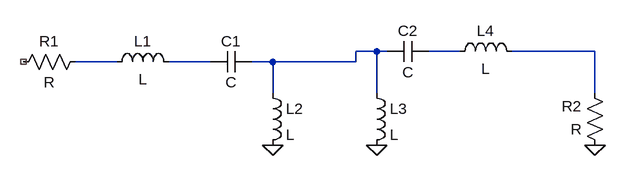
[diagram p0: schematic Draft7.asc]
Draft7.asc, the LTspice schematic file:
Version 4
SHEET 1 880 680
WIRE 368 112 336 112
WIRE 384 112 368 112
WIRE 496 112 448 112
WIRE 704 112 576 112
WIRE -32 128 -96 128
WIRE 112 128 48 128
WIRE 208 128 176 128
WIRE 336 128 336 112
WIRE 336 128 208 128
WIRE 208 176 208 128
WIRE 368 176 368 112
WIRE 704 176 704 112
FLAG 368 256 0
FLAG 704 256 0
FLAG 208 256 0
SYMBOL res -80 112 R90
WINDOW 0 0 56 VBottom 2
WINDOW 3 32 56 VTop 2
SYMATTR InstName R1
SYMBOL res 720 272 R180
WINDOW 0 36 76 Left 2
WINDOW 3 36 40 Left 2
SYMATTR InstName R2
SYMBOL ind -48 144 R270
WINDOW 0 32 56 VTop 2
WINDOW 3 5 56 VBottom 2
SYMATTR InstName L1
SYMBOL ind 192 160 R0
SYMATTR InstName L2
SYMBOL ind 352 160 R0
SYMATTR InstName L3
SYMBOL ind 480 128 R270
WINDOW 0 32 56 VTop 2
WINDOW 3 5 56 VBottom 2
SYMATTR InstName L4
SYMBOL cap 176 112 R90
WINDOW 0 0 32 VBottom 2
WINDOW 3 32 32 VTop 2
SYMATTR InstName C1
SYMBOL cap 448 96 R90
WINDOW 0 0 32 VBottom 2
WINDOW 3 32 32 VTop 2
SYMATTR InstName C2

The netlist it stands for:
* Draft7.asc
R1 N004 NC_01 R
R2 0 N003 R
L1 N004 N005 L
L2 N001 0 L
L3 N001 0 L
L4 N002 N003 L
C1 N001 N005 C
C2 N002 N001 C
.backanno
.end